# EAGLE design PCB_Tester1_V1.0 (EAGLE 8.6.3)
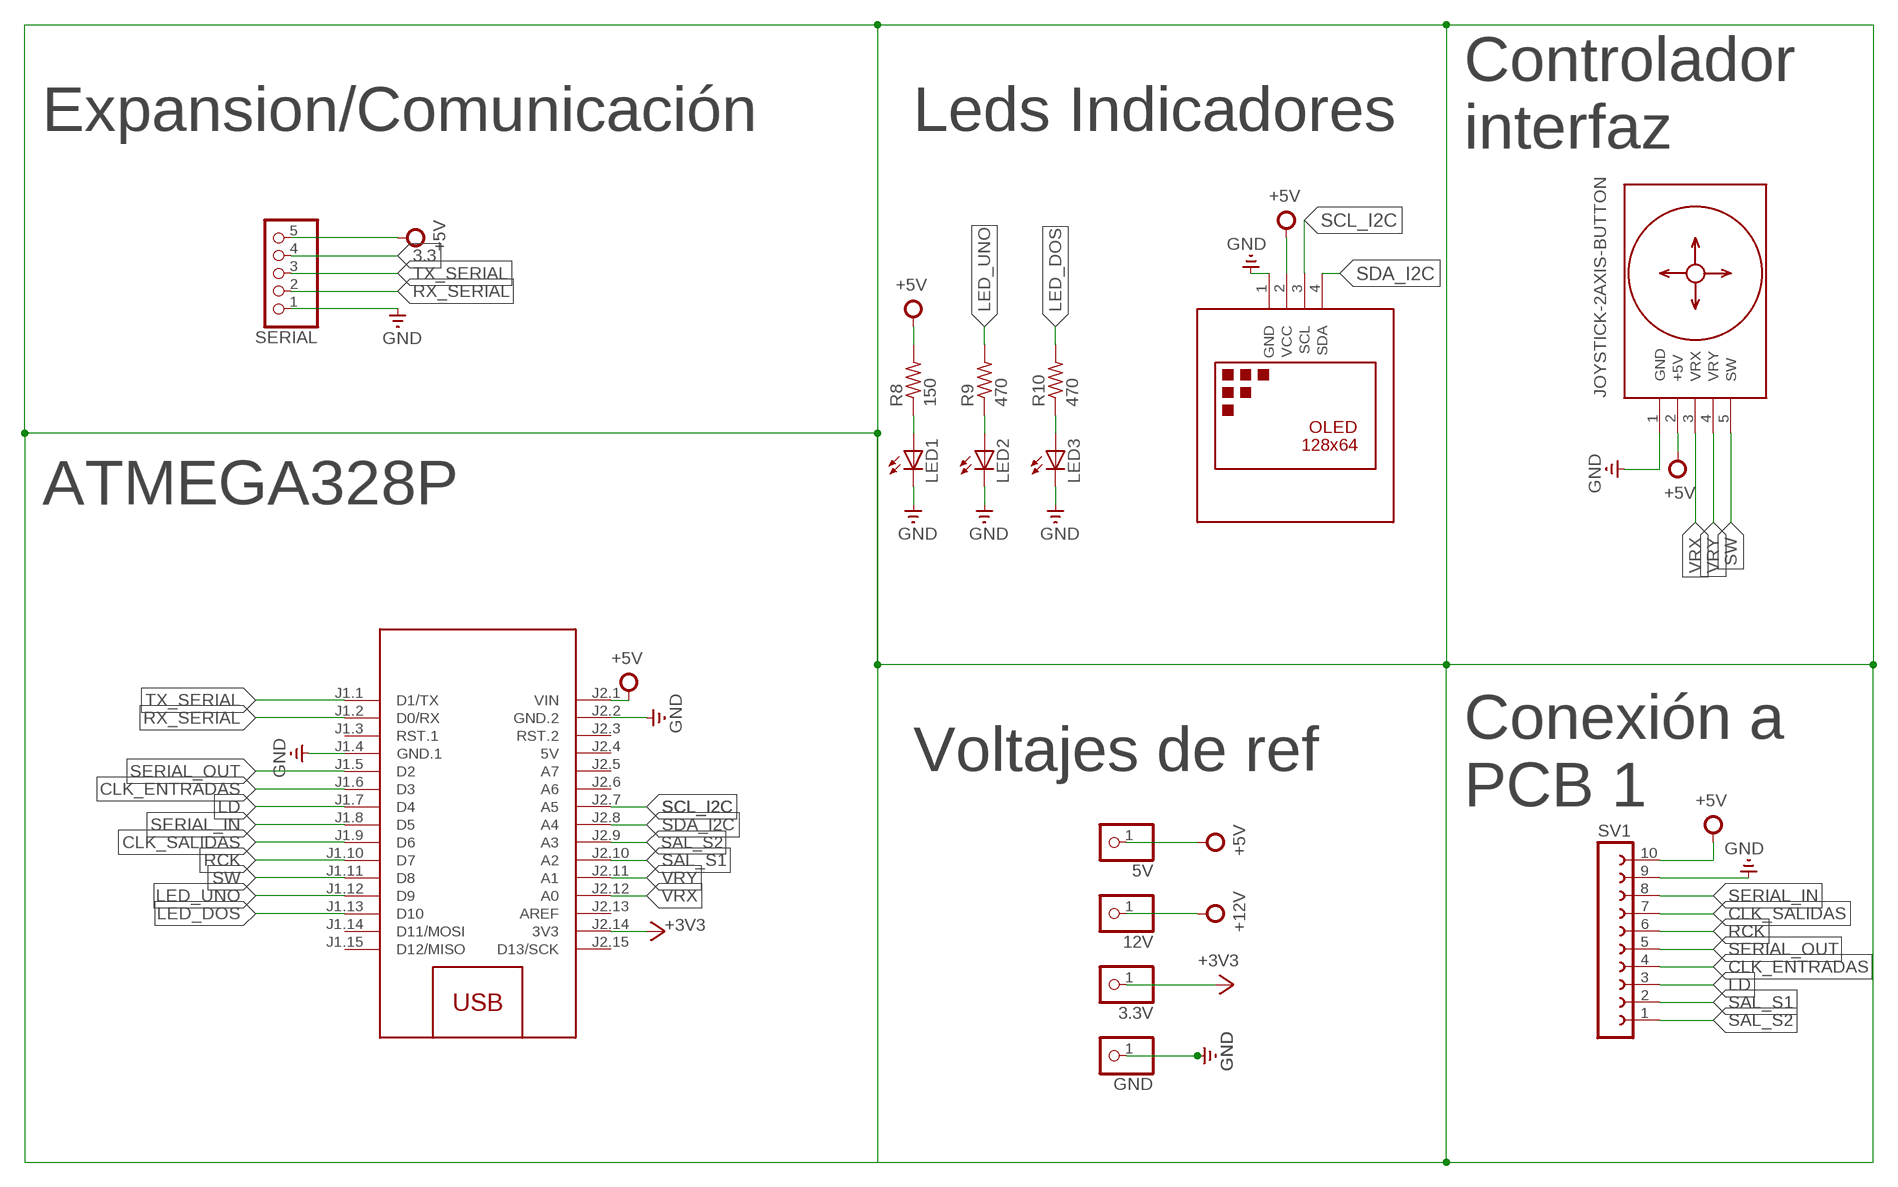
[diagram p0: schematic, sheet 1]

## Parts
3.3V  PINHD-1X1  [1X01]
5V  PINHD-1X1  [1X01]
12V  PINHD-1X1  [1X01]
GND  PINHD-1X1  [1X01]
LED1  LED5MM  [LED5MM]
LED2  LED5MM  [LED5MM]
LED3  LED5MM  [LED5MM]
M2  ARDUINO-NANO-3.0  [ARDUINO-NANO-3.0]
R8  150  R-US_0207/7  [0207/7]
R9  470  R-US_0207/7  [0207/7]
R10  470  R-US_0207/7  [0207/7]
SERIAL  PINHD-1X5  [1X05]
SV1  FE10-1  [FE10]
U$2  DISPLAY-OLED-128X64-I2C  [DISPLAY-OLED-128X64-I2C]
U$3  JOYSTICK-2AXIS-BUTTON  [JOYSTICK-2AXIS-BUTTON]

## Nets
3.3: SERIAL.4
+3V3: 3.3V.1 M2.J2.14(3V3)
+5V: 5V.1 M2.J2.1(VIN) R8.2 SERIAL.5 SV1.10 U$2.2(VCC) U$3.2(+5V)
+12V: 12V.1
CLK_ENTRADAS: M2.J1.6(D3) SV1.4
CLK_SALIDAS: M2.J1.9(D6) SV1.7
GND: GND.1 LED1.K(C) LED2.K(C) LED3.K(C) M2.J1.4(GND.1) M2.J2.2(GND.2) SERIAL.1 SV1.9 U$2.1(GND) U$3.1(GND)
LD: M2.J1.7(D4) SV1.3
LED_DOS: M2.J1.13(D10) R10.2
LED_UNO: M2.J1.12(D9) R9.2
N$13: LED1.A R8.1
N$14: LED2.A R9.1
N$15: LED3.A R10.1
RCK: M2.J1.10(D7) SV1.6
RX_SERIAL: M2.J1.2(D0/RX) SERIAL.2
SAL_S1: M2.J2.10(A2) SV1.2
SAL_S2: M2.J2.9(A3) SV1.1
SCL_I2C: M2.J2.7(A5) U$2.3(SCL)
SDA_I2C: M2.J2.8(A4) U$2.4(SDA)
SERIAL_IN: M2.J1.8(D5) SV1.8
SERIAL_OUT: M2.J1.5(D2) SV1.5
SW: M2.J1.11(D8) U$3.5(SW)
TX_SERIAL: M2.J1.1(D1/TX) SERIAL.3
VRX: M2.J2.12(A0) U$3.3(VRX)
VRY: M2.J2.11(A1) U$3.4(VRY)
Unconnected: M2.J1.3(RST.1) M2.J1.14(D11/MOSI) M2.J1.15(D12/MISO) M2.J2.3(RST.2) M2.J2.5(A7) M2.J2.6(A6) M2.J2.13(AREF) M2.J2.15(D13/SCK)

## Notes on the sheet
- Expansion/Comunicación | Leds Indicadores
- Controlador
  interfaz
- ATMEGA328P
- Voltajes de ref
- Conexión a 
  PCB 1

## Power pins joined to a net without a drawn wire
5V: M2.J2.4(5V)

## Library data of the parts
3.3V 5V 12V GND = adafruit:PINHD-1X1: Pin header 1x1 for 0.1" spacing With round pins
LED1-LED3 = adafruit:LED: LED OSRAM: - CHIPLED LG R971, LG N971, LY N971, LG Q971, LY Q971, LO R971, LY R971 LH N974, LH R974 LS Q976, LO Q976, LY Q976 LO Q996 - Hyper CHIPLED LW Q18S LB Q993, LB Q99A, LB R99A - SideLED LS A670, LO A670, LY A670, LG A670, LP A670 LB A673, LV A673, LT A673, LW A673 LH A674 LY A675 LS A676, LA A676, LO A676, LY A676, LW A676 LS A679, LY A679, LG A679 - Hyper Micro SIDELED® LS Y876, LA Y876, LO Y876, LY Y876 LT Y87S - SmartLED LW L88C, LW L88S LB L89C, LB L89S, LG L890 LS L89K, LO L89K, LY L89K LS L896, LA L896, LO L896, LY L896 - TOPLED LS T670, LO T670, LY T670, LG T670, LP T670 LSG T670, LSP T670, LSY T670, LOP T670, LYG T670 LG T671, LOG T671, LSG T671 LB T673, LV T673, LT T673, LW T673 LH T674 LS T676, LA T676, LO T676, LY T676, LB T676, LH T676, LSB T676, LW T676 LB T67C, LV T67C, LT T67C, LS T67K, LO T67K, LY T67K, LW E67C LS E67B, LA E67B, LO E67B, LY E67B, LB E67C, LV E67C, LT E67C LW T67C LS T679, LY T679, LG T679 LS T770, LO T770, LY T770, LG T770, LP T770 LB T773, LV T773, LT T773, LW T773 LH T774 LS E675, LA E675, LY E675, LS T675 LS T776, LA T776, LO T776, LY T776, LB T776 LHGB T686 LT T68C, LB T68C - Hyper Mini TOPLED® LB M676 - Mini TOPLED Santana® LG M470 LS M47K, LO M47K, LY M47K Source: http://www.osram.convergy.de/
M2 = diy-modules:ARDUINO-NANO-3.0: Arduino Nano 3.0 and compatible devices More details available here: https://www.arduino.cc/en/Main/ArduinoBoardNano Click here to find device on ebay.com <http://www.ebay.com/sch/arduino+nano>
R8-R10 = rcl:R-US_: RESISTOR, American symbol; SPICEPREFIX: R
SERIAL = pinhead:PINHD-1X5: PIN HEADER
SV1 = con-lsta:FE10-1: FEMALE HEADER; OC_FARNELL: unknown; OC_NEWARK: unknown
U$2 = diy-modules:DISPLAY-OLED-128X64-I2C: 128x64 Dot Matrix OLED Module based on SSD1306 chip Variant with I2C interface More details available here: http://www.instructables.com/id/Monochrome-096-i2c-OLED-display-with-arduino-SSD13/ SSD1306 datasheet: https://cdn-shop.adafruit.com/datasheets/SSD1306.pdf Click here to find device on ebay.com <http://www.ebay.com/sch/oled+display+128x64+iic> Note: There are two variants: I2C and SPI. Search for the proper version.
U$3 = diy-modules:JOYSTICK-2AXIS-BUTTON: 2-Axis Analog Joystick with Push Button Tutorial is available here: http://henrysbench.capnfatz.com/henrys-bench/arduino-sensors-and-input/arduino-ps2-joystick-tutorial-keyes-ky-023-deek-robot/ Click here to find device on ebay.com <http://www.ebay.com/sch/joystick+ps2+module>

## Board
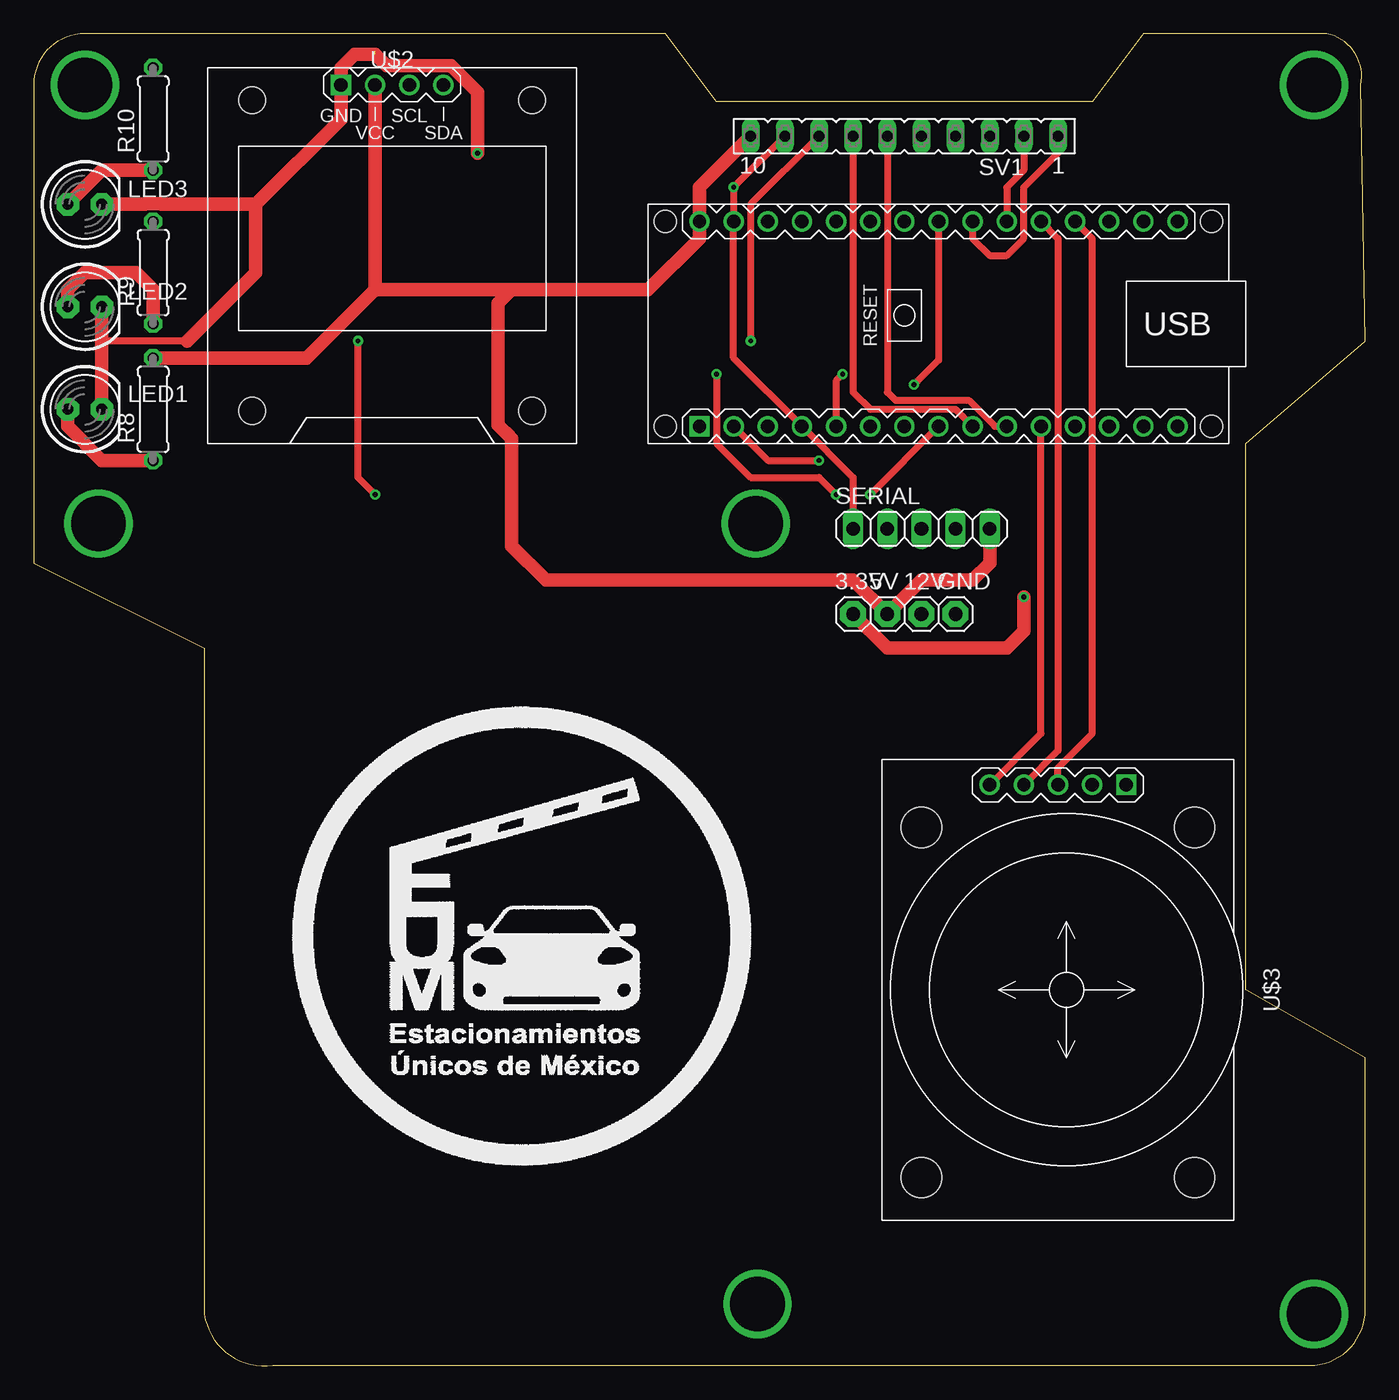
[diagram p1: board, top side]
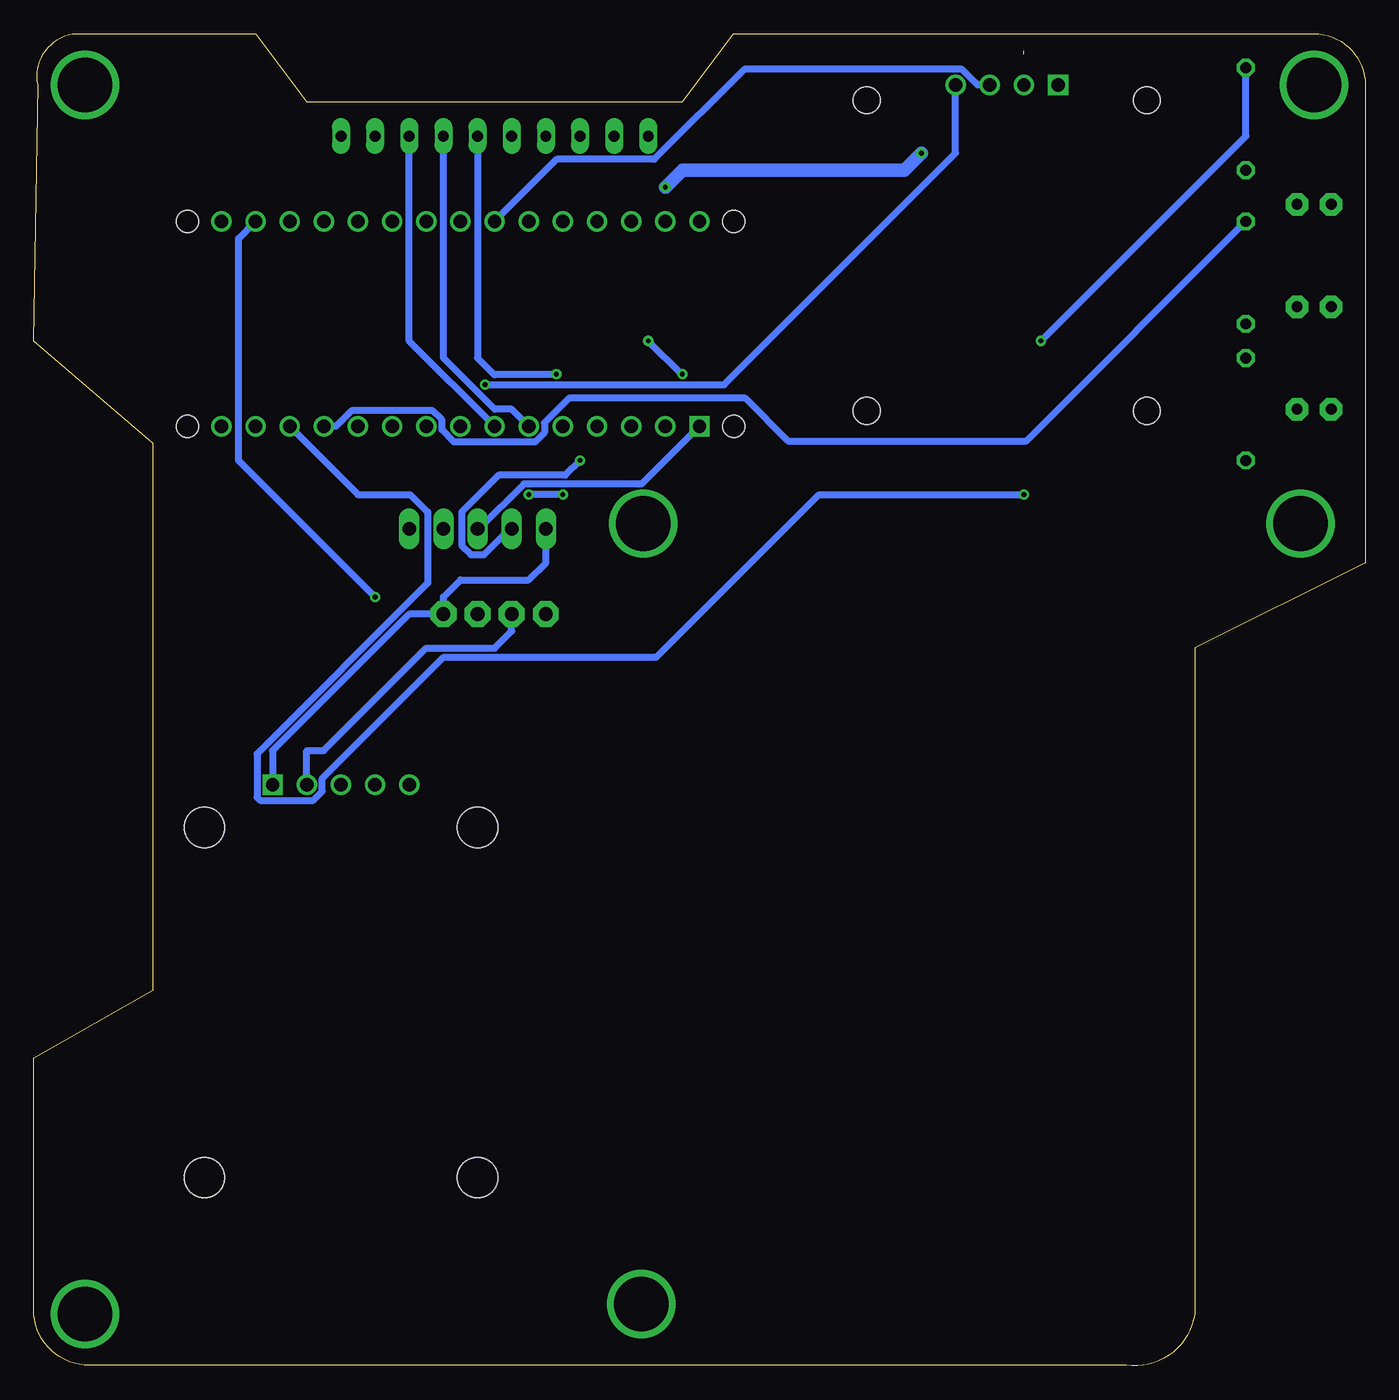
[diagram p2: board, bottom side, seen from below]

Size 99.06 x 99.1 mm. Coordinates in mm from the lower left corner, seen from the top.
Outline: 0,95.28 arc-90 3.81,99.09 46.99,99.1 50.8,94.02 78.74,94.02 82.55,99.1 96.18,99.1 arc-90 98.73,95.28 99.06,76.24 90.17,68.62 90.17,27.98 99.06,22.9 99.06,4.18 arc-90 94.92,0.04 17.78,0.04 arc-90 12.7,3.85 12.7,53.38 0,59.73 0,95.28
Outline: 0,95.29 0,95.28
Copper layers (1*16): Top 0.035mm / dielectric 1.5mm / Bottom 0.035mm
Design rules "default": minimum track width 6mil, minimum drill 0.35mm, track to track 6mil, track to pad 6mil, pad to pad 6mil, via to via 6mil, smd to smd 6mil, copper to edge 40mil, drill to drill 6mil, minimum pad ring 10mil, minimum via ring 8mil, stop-mask expansion 4mil, vias tented up to drill 0mil, thermal gap 10mil

### Footprints (pad centres in the part's own frame; a part is rotated, then mirrored left to right if it is on the bottom)
1X01 = drill 1.016 pad 1.93 octagon: 1 0,0
LED5MM = drill 0.813 pad 1.676 octagon: A -1.27,0; K 1.27,0
ARDUINO-NANO-3.0 = drill 1 square: J1.1 17.78,7.62 | drill 1: J1.2 15.24,7.62; J1.3 12.7,7.62; J1.4 10.16,7.62; J1.5 7.62,7.62; J1.6 5.08,7.62; J1.7 2.54,7.62; J1.8 0,7.62; J1.9 -2.54,7.62; J1.10 -5.08,7.62; J1.11 -7.62,7.62; J1.12 -10.16,7.62; J1.13 -12.7,7.62; J1.14 -15.24,7.62; J1.15 -17.78,7.62; J2.1 17.78,-7.62; J2.2 15.24,-7.62; J2.3 12.7,-7.62; J2.4 10.16,-7.62; J2.5 7.62,-7.62; J2.6 5.08,-7.62; J2.7 2.54,-7.62; J2.8 0,-7.62; J2.9 -2.54,-7.62; J2.10 -5.08,-7.62; J2.11 -7.62,-7.62; J2.12 -10.16,-7.62; J2.13 -12.7,-7.62; J2.14 -15.24,-7.62; J2.15 -17.78,-7.62 | hole 1.651: -20.32,7.62; -20.32,-7.62; 20.32,-7.62; 20.32,7.62
0207/7 = drill 0.813 octagon: 1 -3.81,0; 2 3.81,0
1X05 = drill 1.016 long: 1 -5.08,0; 2 -2.54,0; 3 0,0; 4 2.54,0; 5 5.08,0
FE10 = drill 0.813 long: 1 -11.43,0; 2 -8.89,0; 3 -6.35,0; 4 -3.81,0; 5 -1.27,0; 6 1.27,0; 7 3.81,0; 8 6.35,0; 9 8.89,0; 10 11.43,0
DISPLAY-OLED-128X64-I2C = drill 1 square: 1 -3.81,12.7 | drill 1: 2 -1.27,12.7; 3 1.27,12.7; 4 3.81,12.7 | hole 2: -10.414,11.557; 10.414,11.557; 10.414,-11.557; -10.414,-11.557
JOYSTICK-2AXIS-BUTTON = drill 1 square: 1 -15.24,5.08 | drill 1: 2 -15.24,2.54; 3 -15.24,0; 4 -15.24,-2.54; 5 -15.24,-5.08 | hole 3: -12.065,10.16; -12.065,-10.16; 13.97,-10.16; 13.97,10.16

### Placement (x,y rotation side)
3.3V  60.96,55.92 0 top
5V  63.5,55.92 0 top
12V  66.04,55.92 0 top
GND  68.58,55.92 0 top
LED1  3.81,71.16 0 top
LED2  3.81,78.78 0 top
LED3  3.81,86.4 0 top
M2  67.31,77.51 180 top
R8  8.89,71.16 90 top
R9  8.89,81.32 90 top
R10  8.89,92.75 90 top
SERIAL  66.04,62.27 0 top
SV1  64.77,91.48 180 top
U$2  26.67,82.59 0 top
U$3  76.2,27.98 270 top

### Tracks (layer width: path | path; a pad name or v marks a point on that pad's centre or on a via)
+3V3  (via drill 0.35)
  Top 1.016: 3.3V.1 63.5,53.38 72.39,53.38 73.66,54.65 v73.66,57.19
  Bottom 0.508: v73.66,57.19 83.82,67.35 83.82,83.86 M2.J2.14
+5V
  Top 0.508: 49.53,87.67 M2.J2.1 49.53,83.86 | 35.29,69.62 35.56,69.35 35.56,61
  Top 1.016: R8.2 20.32,74.97 25.4,80.05 | U$2.2 25.4,80.05 | 25.4,80.05 35.56,80.05 | 35.56,80.05 45.72,80.05 49.53,83.86 49.53,87.67 SV1.10 | 35.56,80.05 34.56,79.05 34.56,69.99 35.56,68.99 35.56,61 38.1,58.46 60.96,58.46 5V.1 66.04,58.46 69.85,58.46 71.12,59.73 SERIAL.5
  Bottom 0.508: U$3.2 78.74,45.76 77.47,45.76 69.85,53.38 64.77,53.38 63.5,54.65 5V.1
CLK_ENTRADAS
  Bottom 0.508: M2.J1.6 63.5,71.16 64.77,71.16 68.58,74.97 SV1.4
CLK_SALIDAS
  Top 0.508: SV1.7 60.96,72.43 62.23,71.16 68.58,71.16 M2.J1.9
GND  (via drill 0.35)  (1 unrouted)
  Top 0.508: LED1.K 5.08,76.24 | 5.08,76.24 LED2.K | 11.43,76.24 5.08,76.24 | SV1.9 v52.07,87.67 M2.J2.2 52.07,74.97 M2.J1.4 60.96,66.08 SERIAL.1 | 26.67,96.56 25.41,97.83
  Top 1.016: LED1.K LED2.K | LED3.K 8.29,86.4 8.34,86.45 9.44,86.45 9.49,86.4 16.51,86.4 | 16.51,86.4 22.86,92.75 U$2.1 22.86,96.56 23.88,97.57 25.41,97.57 26.27,96.7 31.07,96.7 33.02,94.75 v33.02,90.21 | 16.51,86.4 16.51,81.32 11.43,76.24
  Bottom 0.508: U$3.1 81.28,45.76 71.12,55.92 GND.1 68.58,57.19 67.31,58.46 62.23,58.46 60.96,59.73 SERIAL.1
  Bottom 1.016: v33.02,90.21 34.29,88.94 50.8,88.94 v52.07,87.67
LD
  Bottom 0.508: M2.J1.7 71.12,76.24 SV1.3
LED_DOS  (via drill 0.35)
  Top 0.508: v25.4,64.81 24.13,66.08 v24.13,76.24
  Bottom 0.508: M2.J1.13 74.93,64.81 71.04,64.81 69.75,63.52 69.75,58.23 82.44,45.53 82.44,42.3 82.2,42.06 78.26,42.06 77.58,42.74 77.58,43.7 68.56,52.72 52.73,52.72 40.64,64.81 39.77,64.81 v25.4,64.81 | v24.13,76.24 8.89,91.48 R10.2
LED_UNO
  Bottom 0.508: M2.J1.12 76.57,69.89 75.41,71.05 69.37,71.05 68.69,70.37 68.69,69.63 67.79,68.73 61.75,68.73 61.07,69.41 61.07,70.15 59.24,71.99 46.12,71.99 42.9,68.76 25.26,68.76 R9.2
N$1  (via drill 4.06)
  other vias: 3.81,95.29
N$2  (via drill 4.06)
  other vias: 95.25,95.29
N$3  (via drill 4.06)
  other vias: 4.83,62.65
N$4  (via drill 4.06)
  other vias: 53.72,62.65
N$5  (via drill 4.06)
  other vias: 53.85,4.61
N$6  (via drill 4.06)
  other vias: 95.25,3.85
N$13
  Top 1.016: LED1.A 2.54,69.89 5.08,67.35 R8.1
N$14
  Top 1.016: LED2.A 2.54,80.05 3.81,81.32 7.62,81.32 8.89,80.05 R9.1
N$15
  Top 1.016: LED3.A 5.08,88.94 R10.1
RCK
  Top 0.508: SV1.6 63.5,72.43 64.11,71.82 69.56,71.82 71.49,69.89 M2.J1.10
RX_SERIAL  (via drill 0.35)
  Top 0.508: M2.J1.2 54.61,67.35 v58.42,67.35
  Bottom 0.508: v58.42,67.35 59.51,66.26 64.47,66.26 67.21,63.52 67.21,61.02 66.52,60.34 65.56,60.34 63.63,62.27 SERIAL.2
SAL_S1
  Top 0.508: SV1.2 73.66,88.94 72.39,87.67 M2.J2.10
SAL_S2
  Top 0.508: M2.J2.9 69.85,83.86 71.12,82.59 72.39,82.59 73.66,83.86 73.66,87.67 76.2,90.21 SV1.1
SCL_I2C
  Bottom 0.508: U$2.3 28.84,95.29 30,96.45 46.2,96.45 52.9,89.75 60.15,89.75 M2.J2.7
SDA_I2C  (via drill 0.35)
  Top 0.508: M2.J2.8 67.31,74.81 v65.48,72.99
  Bottom 0.508: v65.48,72.99 47.7,72.99 30.48,90.21 U$2.4
SERIAL_IN  (via drill 0.35)
  Top 0.508: SV1.8 53.34,86.4 v53.34,76.24 | v50.8,73.77 50.8,68.62 53.34,66.08 58.42,66.08 v59.69,64.81 | v62.23,64.81 M2.J1.8
  Bottom 0.508: v53.34,76.24 50.87,73.77 v50.8,73.77 | v59.69,64.81 v62.23,64.81
SERIAL_OUT  (via drill 0.35)
  Top 0.508: v60.17,73.77 59.69,73.28 M2.J1.5
  Bottom 0.508: SV1.5 66.04,74.97 64.77,73.7 64.7,73.77 v60.17,73.77
SW
  Top 0.508: M2.J1.11 74.93,47.03 U$3.5
TX_SERIAL
  Bottom 0.508: M2.J1.1 53.82,65.6 62.59,65.6 65.91,62.27 SERIAL.3
VRX
  Top 0.508: U$3.3 76.2,44.49 78.74,47.03 78.74,83.86 M2.J2.12
VRY
  Top 0.508: M2.J2.11 76.2,83.86 76.2,45.76 U$3.4